# EAGLE design progBoard (EAGLE 9.6.0)
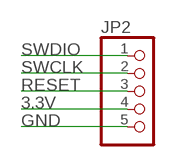
[diagram p0: schematic, sheet 1]

## Parts
JP2  PINHD-1X5  [1X05]

## Nets
3.3V: JP2.4
GND: JP2.5
RESET: JP2.3
SWCLK: JP2.2
SWDIO: JP2.1

## Library data of the parts
JP2 = pinhead:PINHD-1X5: PIN HEADER

## Board
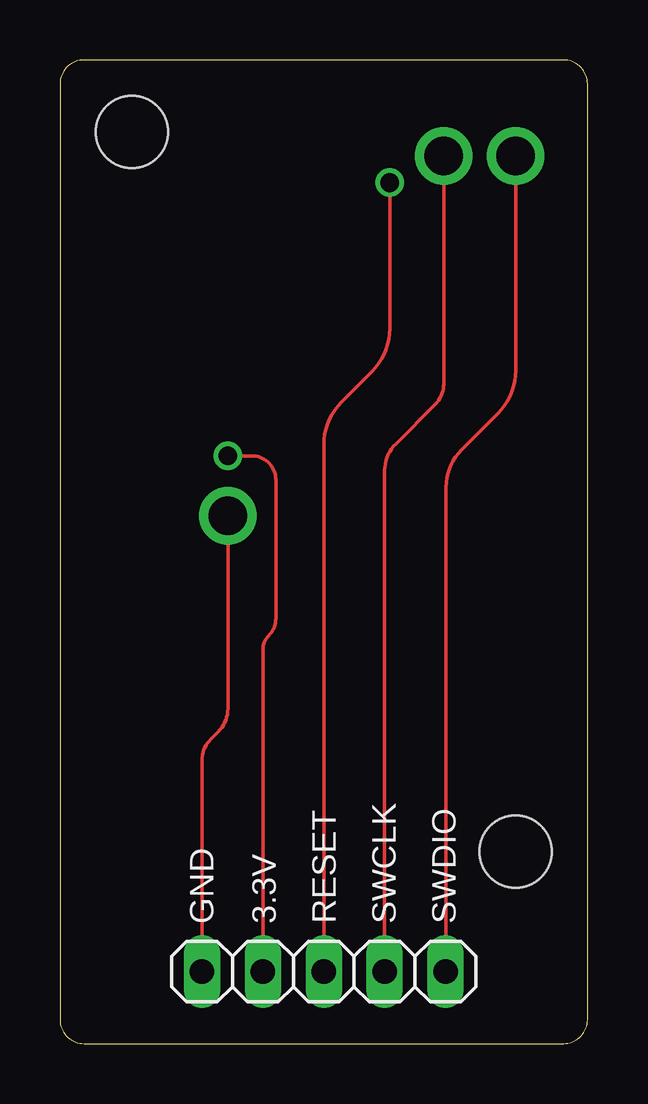
[diagram p1: board, top side]

Size 22 x 41 mm. Coordinates in mm from the lower left corner, seen from the top.
Outline: 0,40 0,1 arc90 1,0 21,0 arc90 22,1 22,40 arc90 21,41 1,41 arc90 0,40
Copper layers (1*16): Top 0.035mm / dielectric 1.5mm / Bottom 0.035mm
Design rules "default": minimum track width 6mil, minimum drill 0.35mm, track to track 6mil, track to pad 6mil, pad to pad 6mil, via to via 6mil, smd to smd 6mil, copper to edge 40mil, drill to drill 6mil, minimum pad ring 10mil, minimum via ring 8mil, stop-mask expansion 4mil, vias tented up to drill 0mil, thermal gap 10mil
Holes 3 mm at 3,38 19,8

### Footprints (pad centres in the part's own frame; a part is rotated, then mirrored left to right if it is on the bottom)
1X05 = drill 1.016 long: 1 -5.08,0; 2 -2.54,0; 3 0,0; 4 2.54,0; 5 5.08,0

### Placement (x,y rotation side)
JP2  11,3 180 top

### Tracks (layer width: path | path; a pad name or v marks a point on that pad's centre or on a via)
3.3V  (via drill 0.78)
  Top 0.152: v7,24.5 8,24.5 arc-90 9,23.5 9,17.72 arc-45 8.7,17 arc45 8.46,16.42 JP2.4
GND  (via drill 1.6)
  Top 0.152: JP2.5 5.92,11.81 arc-45 6.28,12.68 6.6,13 arc45 7,13.97 v7,22
RESET  (via drill 0.78)
  Top 0.152: JP2.3 11,24.95 arc-45 11.74,26.74 13.01,28.01 arc45 13.75,29.8 v13.75,35.89
SWCLK  (via drill 1.6)
  Top 0.152: JP2.2 13.54,23.89 arc-45 14,25 15.65,26.65 arc45 16,27.5 v16,37
SWDIO  (via drill 1.6)
  Top 0.152: JP2.1 16.1,3.02 16.1,23.19 arc-45 16.74,24.74 18.26,26.26 arc45 19,28.05 v19,37

### Text on the board
tNames: GND | 3.3V | RESET | SWCLK | SWDIO